# Altium schematic sheet BQ25703A.SchDoc
size A2
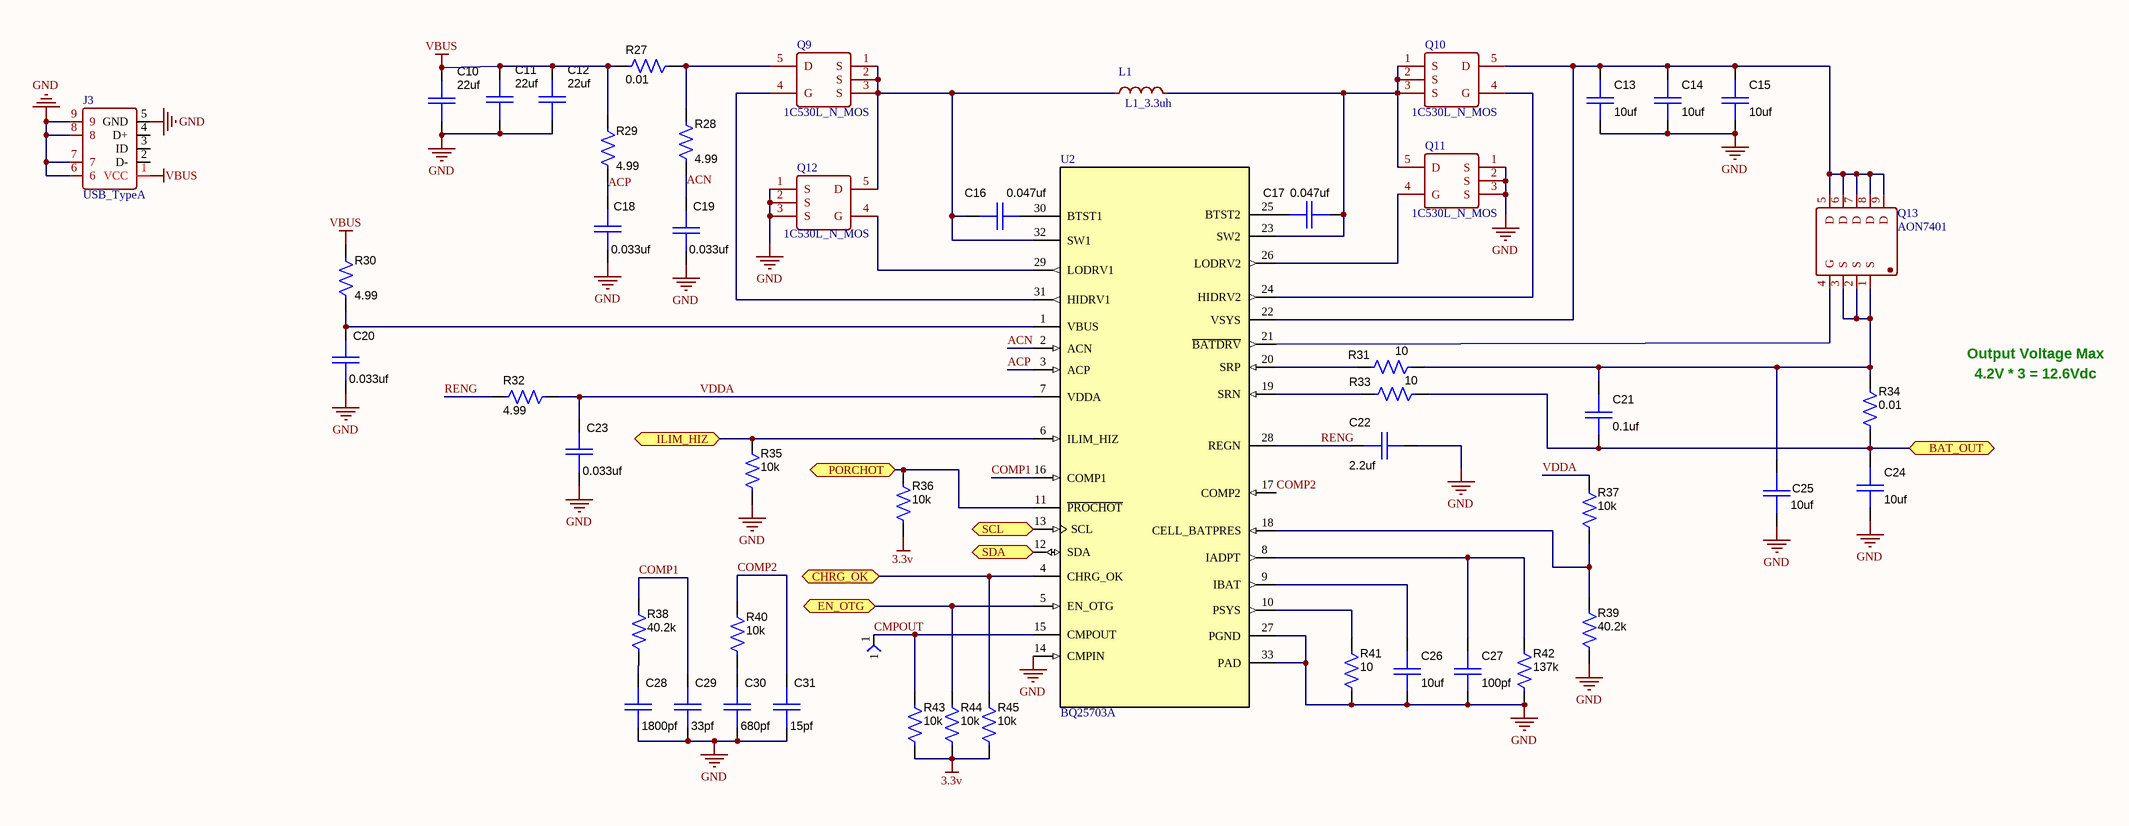
[diagram p0: BQ25703A.SchDoc]

## Parts
C10  value 22uf  [C603]  (hidden comment: C0603C104M5RACTU)
C11  value 22uf  [C603]  (hidden comment: C0603C104M5RACTU)
C12  value 22uf  [C603]  (hidden comment: C0603C104M5RACTU)
C13  value 10uf  [C603]  (hidden comment: C0603C104M5RACTU)
C14  value 10uf  [C603]  (hidden comment: C0603C104M5RACTU)
C15  value 10uf  [C603]  (hidden comment: C0603C104M5RACTU)
C16  value 0.047uf  [C603]  (hidden comment: C0603C104M5RACTU)
C17  value 0.047uf  [C603]  (hidden comment: C0603C104M5RACTU)
C18  value 0.033uf  [C603]  (hidden comment: C0603C104M5RACTU)
C19  value 0.033uf  [C603]  (hidden comment: C0603C104M5RACTU)
C20  value 0.033uf  [C603]  (hidden comment: C0603C104M5RACTU)
C21  value 0.1uf  [C603]  (hidden comment: C0603C104M5RACTU)
C22  value 2.2uf  [C603]  (hidden comment: C0603C104M5RACTU)
C23  value 0.033uf  [C603]  (hidden comment: C0603C104M5RACTU)
C24  value 10uf  [C603]  (hidden comment: C0603C104M5RACTU)
C25  value 10uf  [C603]  (hidden comment: C0603C104M5RACTU)
C26  value 10uf  [C603]  (hidden comment: C0603C104M5RACTU)
C27  value 100pf  [C603]  (hidden comment: C0603C104M5RACTU)
C28  value 1800pf  [C603]  (hidden comment: C0603C104M5RACTU)
C29  value 33pf  [C603]  (hidden comment: C0603C104M5RACTU)
C30  value 680pf  [C603]  (hidden comment: C0603C104M5RACTU)
C31  value 15pf  [C603]  (hidden comment: C0603C104M5RACTU)
J3  USB_TypeA  [USB_TypeA]
L1  L1_3.3uh  [3.3uh]
Q9  1C530L_N_MOS  [LFPAK]
Q10  1C530L_N_MOS  [LFPAK]
Q11  1C530L_N_MOS  [LFPAK]
Q12  1C530L_N_MOS  [LFPAK]
Q13  AON7401  [DFN-8]
R27  value 0.01  [0603]  (hidden comment: CRCW0603100RJNEAHP)
R28  value 4.99  [0603]  (hidden comment: CRCW0603100RJNEAHP)
R29  value 4.99  [0603]  (hidden comment: CRCW0603100RJNEAHP)
R30  value 4.99  [0603]  (hidden comment: CRCW0603100RJNEAHP)
R31  value 10  [0603]  (hidden comment: CRCW0603100RJNEAHP)
R32  value 4.99  [0603]  (hidden comment: CRCW0603100RJNEAHP)
R33  value 10  [0603]  (hidden comment: CRCW0603100RJNEAHP)
R34  value 0.01  [0603]  (hidden comment: CRCW0603100RJNEAHP)
R35  value 10k  [0603]  (hidden comment: CRCW0603100RJNEAHP)
R36  value 10k  [0603]  (hidden comment: CRCW0603100RJNEAHP)
R37  value 10k  [0603]  (hidden comment: CRCW0603100RJNEAHP)
R38  value 40.2k  [0603]  (hidden comment: CRCW0603100RJNEAHP)
R39  value 40.2k  [0603]  (hidden comment: CRCW0603100RJNEAHP)
R40  value 10k  [0603]  (hidden comment: CRCW0603100RJNEAHP)
R41  value 10  [0603]  (hidden comment: CRCW0603100RJNEAHP)
R42  value 137k  [0603]  (hidden comment: CRCW0603100RJNEAHP)
R43  value 10k  [0603]  (hidden comment: CRCW0603100RJNEAHP)
R44  value 10k  [0603]  (hidden comment: CRCW0603100RJNEAHP)
R45  value 10k  [0603]  (hidden comment: CRCW0603100RJNEAHP)
TP7  TP_40_SMT  [TP_40_SMT]  (value not drawn)  (no BOM)
U2  BQ25703A  [BQ25703A]

## Ports
BAT_OUT, CHRG_OK, EN_OTG, ILIM_HIZ, PORCHOT, SCL, SDA

## Nets
3.3v: R36.2 R43.2 R44.2 R45.2
GND: C10.2 C11.2 C12.2 C13.1 C14.1 C15.1 C18.2 C19.2 C20.2 C22.1 C23.2 C24.1 C25.1 C26.1 C27.1 C28.2 C29.2 C30.2 C31.2 J3.5(GND) J3.6 J3.7 J3.8 J3.9 Q11.1(S) Q11.2(S) Q11.3(S) Q12.1(S) Q12.2(S) Q12.3(S) R35.2 R39.2 R41.2 R42.2 U2.14(CMPIN) U2.27(PGND) U2.33(PAD)
VBUS: C10.1 C11.1 C12.1 J3.1(VCC) R27.2 R29.1 R30.2
ACN: C19.1 R28.1 U2.2(ACN)
ACP: C18.1 R29.2 U2.3(ACP)
BAT_OUT: C21.1 C24.2 R33.1 R34.2 ; port BAT_OUT
CHRG_OK: R45.1 U2.4(CHRG_OK) ; port CHRG_OK
CMPOUT: R43.1 TP7.1 U2.15(CMPOUT)
COMP1: C29.1 R38.1 U2.16(COMP1)
COMP2: C31.1 R40.1 U2.17(COMP2)
EN_OTG: R44.1 U2.5(EN_OTG) ; port EN_OTG
ILIM_HIZ: R35.1 U2.6(ILIM_HIZ) ; port ILIM_HIZ
PORCHOT: R36.1 U2.11(~{PROCHOT}) ; port PORCHOT
RENG: C22.2 R32.2 U2.28(REGN)
SCL: U2.13(SCL) ; port SCL
SDA: U2.12(SDA) ; port SDA
VDDA: C23.1 R32.1 R37.1 U2.7(VDDA)
NetC13_2: C13.2 C14.2 C15.2 Q10.5(D) Q13.5(D) Q13.6(D) Q13.7(D) Q13.8(D) Q13.9(D) U2.22(VSYS)
NetC16_1: C16.1 U2.30(BTST1)
NetC16_2: C16.2 L1.1 Q9.1(S) Q9.2(S) Q9.3(S) Q12.5(D) U2.32(SW1)
NetC17_1: C17.1 U2.25(BTST2)
NetC17_2: C17.2 L1.2 Q10.1(S) Q10.2(S) Q10.3(S) Q11.5(D) U2.23(SW2)
NetC20_1: C20.1 R30.1 U2.1(VBUS)
NetC21_2: C21.2 C25.2 Q13.1(S) Q13.2(S) Q13.3(S) R31.1 R34.1
NetC26_2: C26.2 U2.9(IBAT)
NetC27_2: C27.2 R42.1 U2.8(IADPT)
NetC28_1: C28.1 R38.2
NetC30_1: C30.1 R40.2
NetQ9_4: Q9.4(G) U2.31(HIDRV1)
NetQ9_5: Q9.5(D) R27.1 R28.2
NetQ10_4: Q10.4(G) U2.24(HIDRV2)
NetQ11_4: Q11.4(G) U2.26(LODRV2)
NetQ12_4: Q12.4(G) U2.29(LODRV1)
NetQ13_4: Q13.4(G) U2.21(~{BATDRV})
NetR31_2: R31.2 U2.20(SRP)
NetR33_2: R33.2 U2.19(SRN)
NetR37_2: R37.2 R39.1 U2.18(CELL_BATPRES)
NetR41_1: R41.1 U2.10(PSYS)

Not connected (* = marked no-connect by the designer): J3 2(D-) 3(ID) 4(D+)

## Notes on the sheet
- 4.2V * 3 = 12.6Vdc
- Output Voltage Max

## Library data of the parts
C10-C31 = C0603: Capacitor, Ceramic Chip, 50V, X7R, ±20%; Manufacturer: Kemet; Area: 5650; ComponentHeight: 0.035 inch; SymbolVersion: 07/31/2009 12:17:27; PartNumber: C0603C104M5RACTU; PackageReference: 603; ComponentLink1Description: AEO Datasheet Link
R27-R45 = R0603_1%: Resistor, Chip, 1/10W, 5%; Manufacturer: Vishay-Dale; Area: 9100; SymbolVersion: 05/06/2011 13:51:33; PackageReference: 603; PartNumber: CRCW0603100RJNEAHP; ComponentLink1Description: AEO Datasheet Link
TP7 = TP_40_SMT: Test point, 40 mil SMT; Manufacturer: None; Value: None; ComponentHeight: None; SymbolVersion: 07/13/2010 09:50:06; area: *; PackageReference: None; PartNumber: None; ComponentLink1Description: AEO Datasheet Link